# Altium schematic sheet PWM_Controller.SchDoc
size 420 x 297 mm; DocumentNumber: Введите номер платы + Э3; SheetNumber: 3; Format: A3
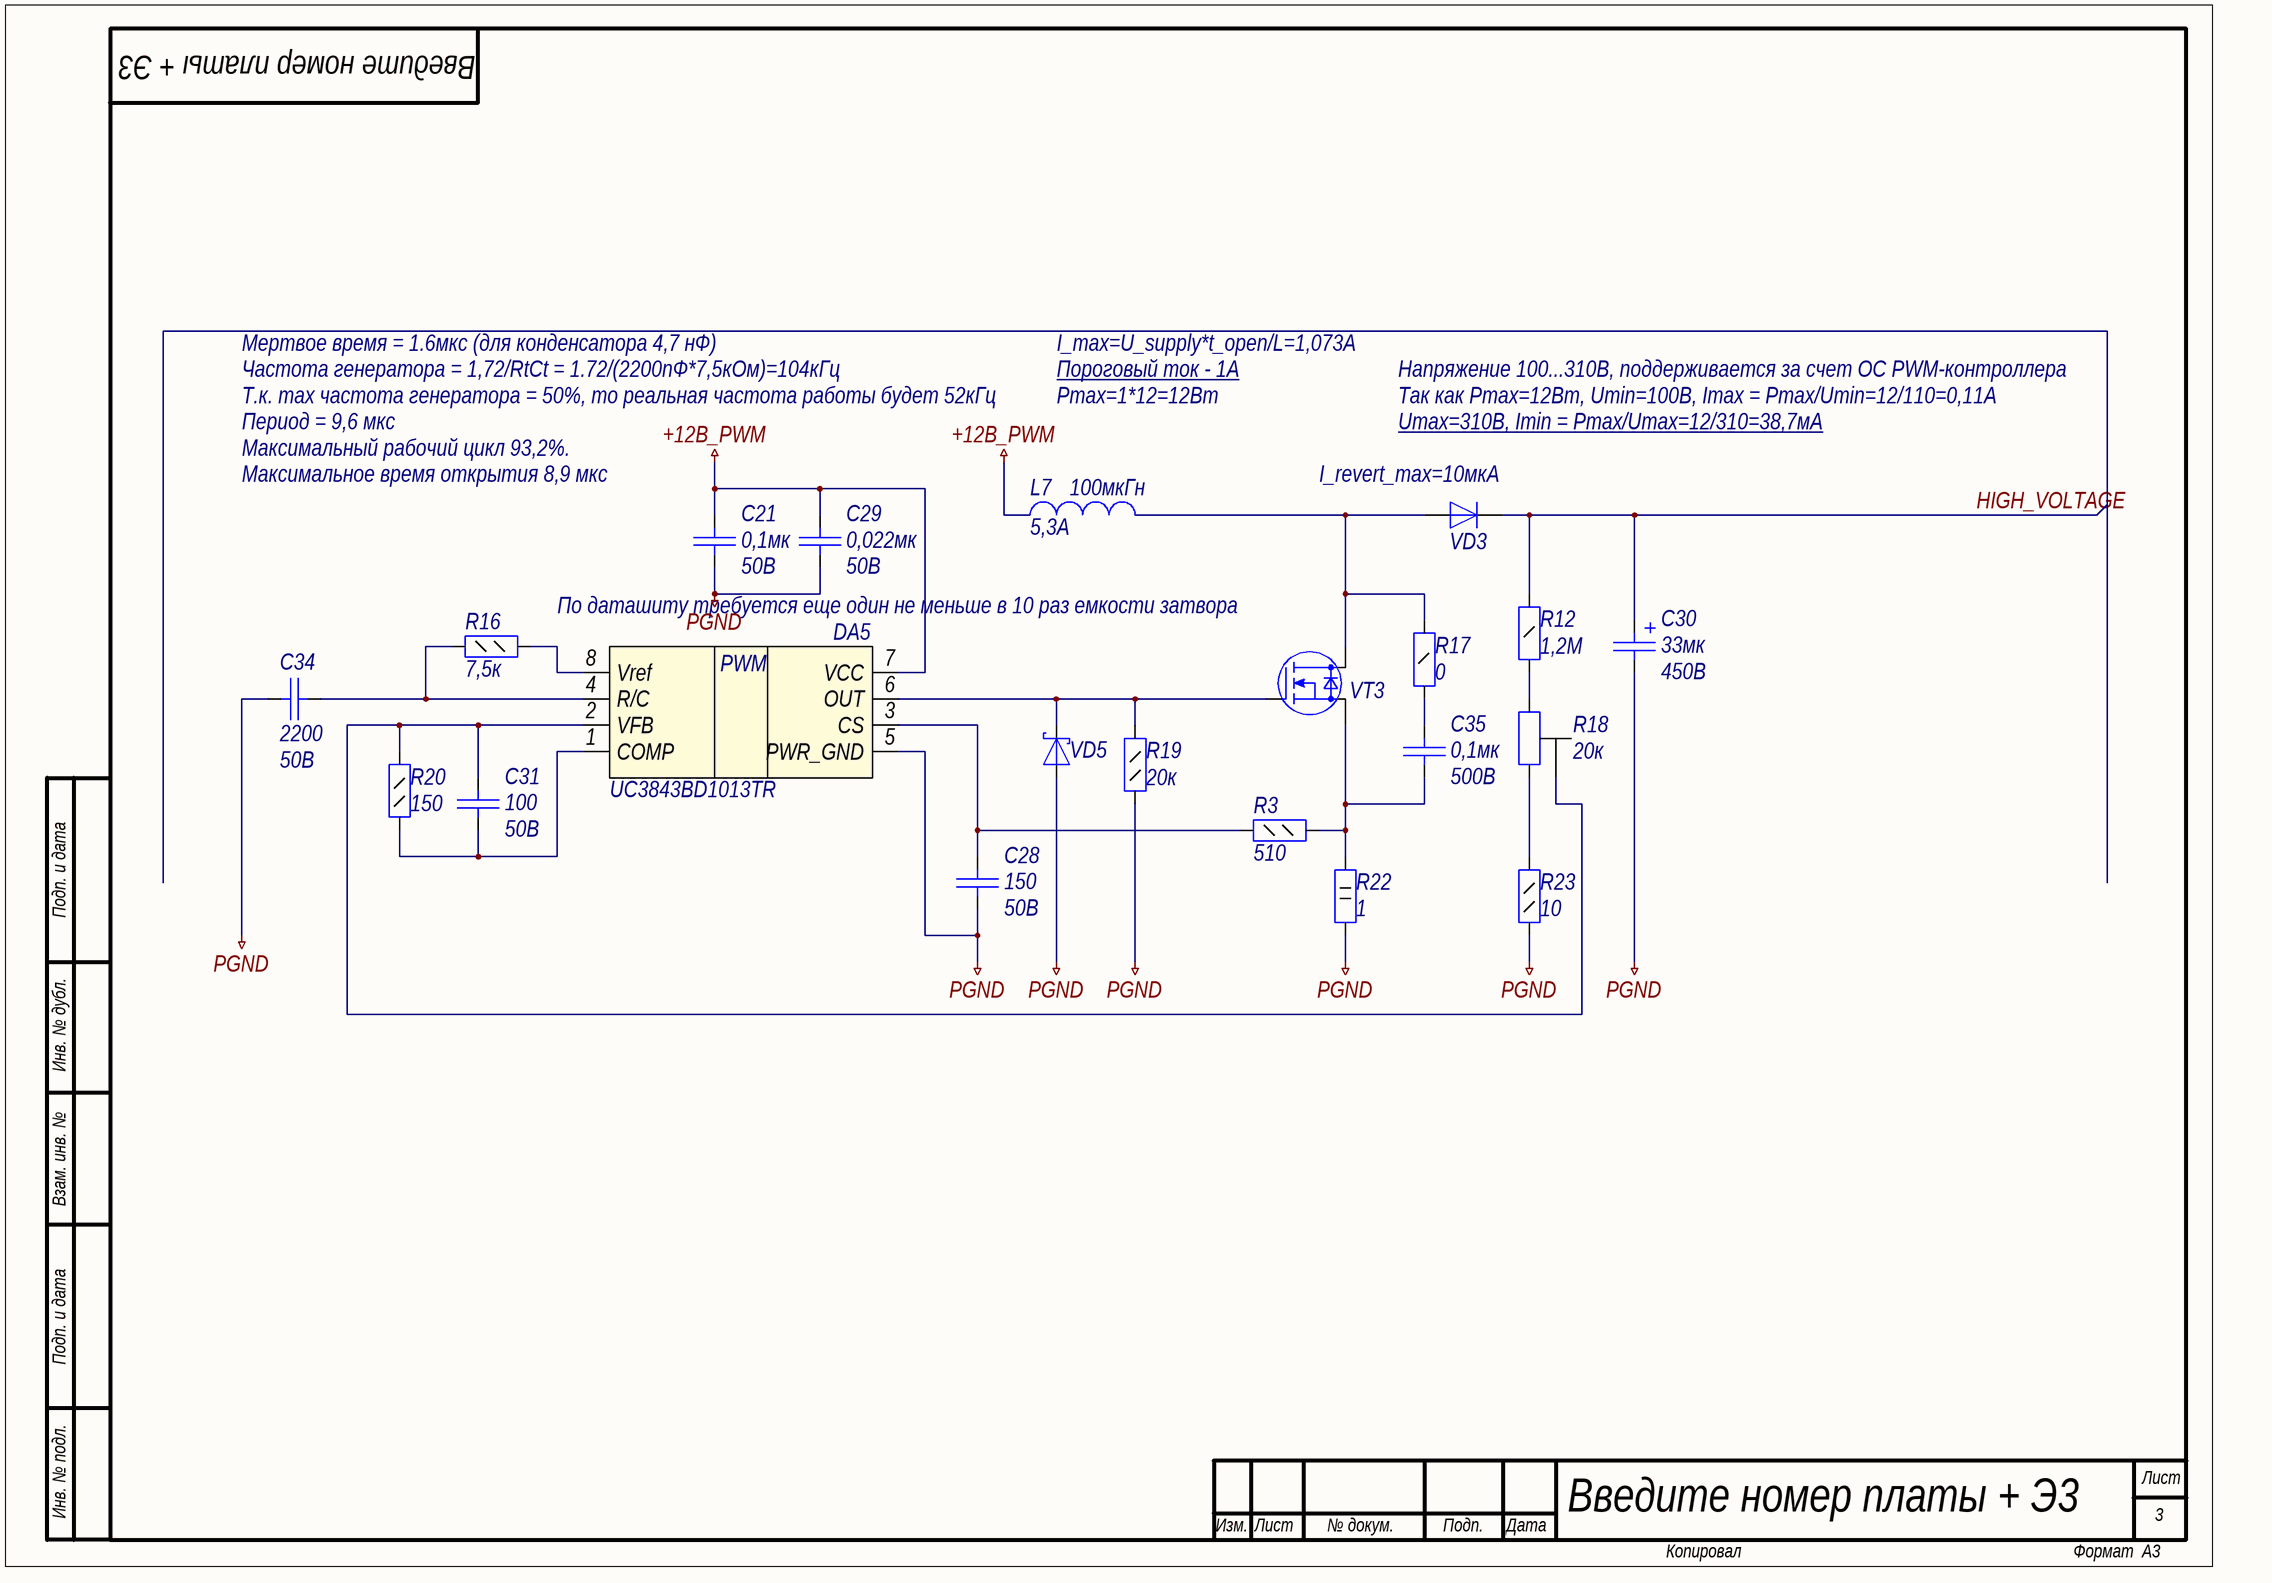
[diagram p0: PWM_Controller.SchDoc]

## Parts
C21  value 0,1мк  Voltage: 50В  [C0805]  (hidden comment: Capacitor)
C28  value 150  Voltage: 50B  [C0603]  (hidden comment: Capacitor)
C29  value 0,022мк  Voltage: 50В  [C1206]  (hidden comment: Capacitor)
C30  value 33мк  Voltage: 450В  [K50-35(16X32)]  (hidden comment: Capacitor_pol)
C31  value 100  Voltage: 50B  [C0603]  (hidden comment: Capacitor)
C34  value 2200  Voltage: 50В  [C0805]  (hidden comment: Capacitor)
C35  value 0,1мк  Voltage: 500В  [C1210]  (hidden comment: Capacitor)
DA5  Part Number: UC3843BD1013TR  [SO8]  (hidden comment: UC384X)
L7  value 100мкГн  Rated Current: 5,3A  [SRP1770TA]  (hidden comment: Inductor)
R3  value 510  [R1206]  (hidden comment: Resistor_0,25Вт)
R12  value 1,2М  [R1206]  (hidden comment: Resistor_0,25Вт)
R16  value 7,5к  [R0805]  (hidden comment: Resistor_0,125Вт)
R17  value 0  [R1206]  (hidden comment: Resistor_0,25Вт)
R18  value 20к  [3296Y]  (hidden comment: Potentiometer)
R19  value 20к  [R0805]  (hidden comment: Resistor_0,125Вт)
R20  value 150  [R0805]  (hidden comment: Resistor_0,125Вт)
R22  1  [KNP-2]
R23  value 10  [R0805]  (hidden comment: Resistor_0,125Вт)
VD3  Diode  [SMA]  (value not drawn)
VD5  DiodeSchottky  [SOD-123]  (value not drawn)
VT3  N-MOSFET  [D2PAK]  (value not drawn)

## Nets
+12В_PWM: C21.2 C29.2 DA5.7(VCC) L7.1
PGND: C21.1 C28.1 C29.1 C30.2 C34.1 DA5.5(PWR_GND) R19.1 R22.1 R23.1 VD5.2(A)
HIGH_VOLTAGE: C30.1 R12.2 VD3.1(K)
NetC28_2: C28.2 DA5.3(CS) R3.1
NetC31_1: C31.1 DA5.1(COMP) R20.1
NetC31_2: C31.2 DA5.2(VFB) R18.2 R20.2
NetC34_2: C34.2 DA5.4(R/C) R16.1
NetC35_1: C35.1 R3.2 R22.2 VT3.3(S)
NetC35_2: C35.2 R17.1
NetDA5_6: DA5.6(OUT) R19.2 VD5.1(K) VT3.1(G)
NetDA5_8: DA5.8(Vref) R16.2
NetL7_2: L7.2 R17.2 VD3.2(A) VT3.2(D)
NetR12_1: R12.1 R18.1
NetR18_3: R18.3 R23.2

## Notes on the sheet
- Частота генератора = 1,72/RtCt = 1.72/(2200пФ*7,5кОм)=104кГц
- Мертвое время = 1.6мкс (для конденсатора 4,7 нФ)
- I_max=U_supply*t_open/L=1,073А
- Пороговый ток - 1А
- Напряжение 100...310В, поддерживается за счет ОС PWM-контроллера
- Т.к. max частота генератора = 50%, то реальная частота работы будет 52кГц
- Период = 9,6 мкс
- Максимальный рабочий цикл 93,2%.
- Pmax=1*12=12Вт
- Так как Pmax=12Вт, Umin=100В, Imax = Pmax/Umin=12/110=0,11А
- Umax=310В, Imin = Pmax/Umax=12/310=38,7мА
- Максимальное время открытия 8,9 мкс
- (near VD3) I_revert_max=10мкА
- По даташиту требуется еще один не меньше в 10 раз емкости затвора
- Подп. и дата
- Инв. № дубл.
- Взам. инв. №
- Инв. № подл.
- Лист
- Изм.
- № докум.
- Подп.
- Дата
- Копировал
- Формат
- (in symbol driver22) PWM

## Library data of the parts
C21 = cap160: Конденсатор; Part Name: Ceramic; Manufacture: Murata; Part Number: GRM21BR71H104KA01L; id: cap160; TKE: X7R
C28 = cap93: Конденсатор; Part Name: Ceramic; Manufacture: Murata; Part Number: GRM1885C1H151J; id: cap93; TKE: NP0
C29 = cap175: Конденсатор; Part Name: Ceramic; Manufacture: Murata; Part Number: GRM319R71H223K; id: cap175; TKE: X7R
C30 = cap257: Конденсатор полярный; Part Name: Electrolit; Manufacture: Тайвань; Part Number: ECAP33uF/450V; id: cap257; tga: 0.20%
C31 = cap91: Конденсатор; Part Name: Ceramic; Manufacture: Murata; Part Number: GRM1885C1H101J; id: cap91; TKE: NP0
C34 = cap168: Конденсатор; Part Name: Ceramic; Manufacture: Murata; Part Number: GRM216R71H222K; id: cap168; TKE: X7R
C35 = cap237: Конденсатор; Part Name: Ceramic; Manufacture: Kemet; Part Number: C1210C104KCRACTU; id: cap237; TKE: X7R
DA5 = driver22: Current Mode PWM  Controller for Forward and  Flyback Applications; Manufacture: ST Microelectronics; Min Operating Supply Voltage: 7,8B; Max Operating Supply Voltage: 9B; Duty Cycle max: 1; id: driver22; Part Name: PWM Controller for Forward and Flyback Applications
L7 = ind134: EMI Suppression Filter; Part Name: SMD Power Inductors; Part Number: SRP1770TA-101M; Manufacture: Bourns; id: ind134; Saturation Current: 6,5A; Resistance: 0,118Ohm; q-factor: 20
R3 = res66: Резистор; Manufacture: Yageo; Part Number: RC0805FR-07510RL; id: res66; Accuracy: 0.01; Power: 0,125Вт; Part Name: Resistor
R12 = res726: Резистор; Manufacture: Yageo; Part Number: RC1206FR-071M2; id: res726; Accuracy: 0.01; Power: 0,25Вт; Part Name: Resistor
R16 = res94: Резистор; Manufacture: Yageo; Part Number: RC0805FR-077K5; id: res94; Accuracy: 0.01; Part Name: Resistor; Power: 0,125Вт
R17 = res579: Резистор; Manufacture: Yageo; Part Number: RC1206FR-070RL; id: res579; Accuracy: 0.01; Power: 0,25Вт; Part Name: Resistor
R18 = res987: Part Name: Resistor; Manufacture: Bourns; Part Number: 3296Y-1-203LF; id: res987; Accuracy: 0.1; Power: 0,5Вт
R19 = res104: Резистор; Manufacture: Yageo; Part Number: RC0805FR-0720KL; id: res104; Accuracy: 0.01; Part Name: Resistor; Power: 0,125Вт
R20 = res53: Резистор; Manufacture: Yageo; Part Number: RC0805FR-07150RL; id: res53; Accuracy: 0.01; Part Name: Resistor; Power: 0,125Вт
R22 = res988: Резистор; Part Name: Resistor; Manufacture: Тайвань; Part Number: KNP-2W-1KJ; id: res988; Accuracy: 0.05; Power: 2Вт; Value: 1
R23 = res25: Резистор; Manufacture: Yageo; Part Number: RC0805FR-0710RL; id: res25; Accuracy: 0.01; Part Name: Resistor; Power: 0,125Вт
VD3 = diode0: Диод; Part Number: GS1M; id: diode0; Max Reverse Voltage: 1000B; Forward Voltage: 1,1B; Forward Current: 1A; Part Name: Diode
VD5 = diode16: Диод Шоттки; Part Number: MBR0520LT1; Manufacture: ON Semiconductor; Max Reverse Voltage: 20B; Forward Voltage: 0,385B; Forward Current: 0,5А; Breakdown Current: 5,5А; Capacitance: 10pF; Number of Channels: 1; id: diode16; Part Name: Diode Schottky
VT3 = trans10: Part Number: IRF840ASPBF; Manufacturer: Vishay; Structure: n-channel; V drain-source max: 500B; Rds: 0,85Ohm; Gate-to-source voltage: (+-)30B; Continuous drain current: 8A; Pulsed drain current: 32A; Power dissipation: 125W; id: trans10